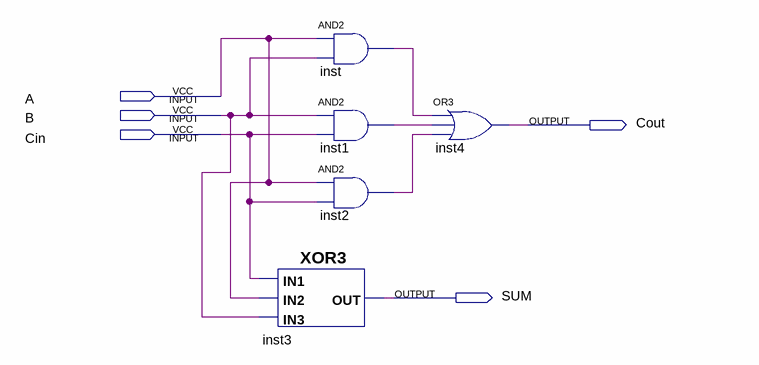
[diagram p0: schematic sheet]
// Quartus schematic FA.bdf as structural Verilog: 5 symbols, 5 pins
module FA (
  input  A,
  input  B,
  input  Cin,
  output Cout,
  output SUM
);

  wire inst1_out, inst2_out, inst_out;

  XOR3 inst3 (.IN3(B), .IN1(Cin), .IN2(A), .OUT(SUM));
  and inst (inst_out, A, B);
  and inst1 (inst1_out, B, Cin);
  and inst2 (inst2_out, A, Cin);
  or inst4 (Cout, inst_out, inst1_out, inst2_out);
endmodule
